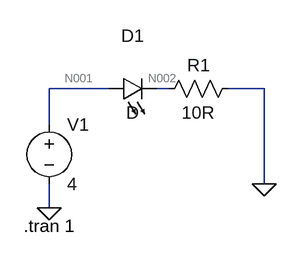
[diagram p0: schematic DRAFT1.asc]
DRAFT1.asc, the LTspice schematic file:
Version 4
SHEET 1 880 680
WIRE 64 80 -16 80
WIRE 144 80 128 80
WIRE 272 80 224 80
WIRE -16 128 -16 80
WIRE 272 208 272 80
WIRE -16 240 -16 208
FLAG 272 208 0
FLAG -16 240 0
SYMBOL voltage -16 112 R0
WINDOW 123 0 0 Left 0
WINDOW 39 0 0 Left 0
SYMATTR InstName V1
SYMATTR Value 4
SYMBOL LED 64 96 R270
WINDOW 0 72 32 VTop 2
WINDOW 3 0 32 VBottom 2
SYMATTR InstName D1
SYMBOL res 240 64 R90
WINDOW 0 0 56 VBottom 2
WINDOW 3 32 56 VTop 2
SYMATTR InstName R1
SYMATTR Value 10R
TEXT -50 264 Left 2 !.tran 1

The netlist it stands for:
* DRAFT1.asc
V1 N001 0 4
D1 N001 N002 D
R1 0 N002 10R
.model D D
.lib standard.dio
.tran 1
.backanno
.end

* Results of the author's LTspice run, read from the files saved beside the schematic
* Operating Point, zero values left out:
*   V(n001) = 4 V
*   V(n002) = 3.196 V
*   I(D1) = 319.6 mA
*   I(R1) = -319.6 mA
*   I(V1) = -319.6 mA